# EAGLE design EVSE (EAGLE 6.5.0)
půkl
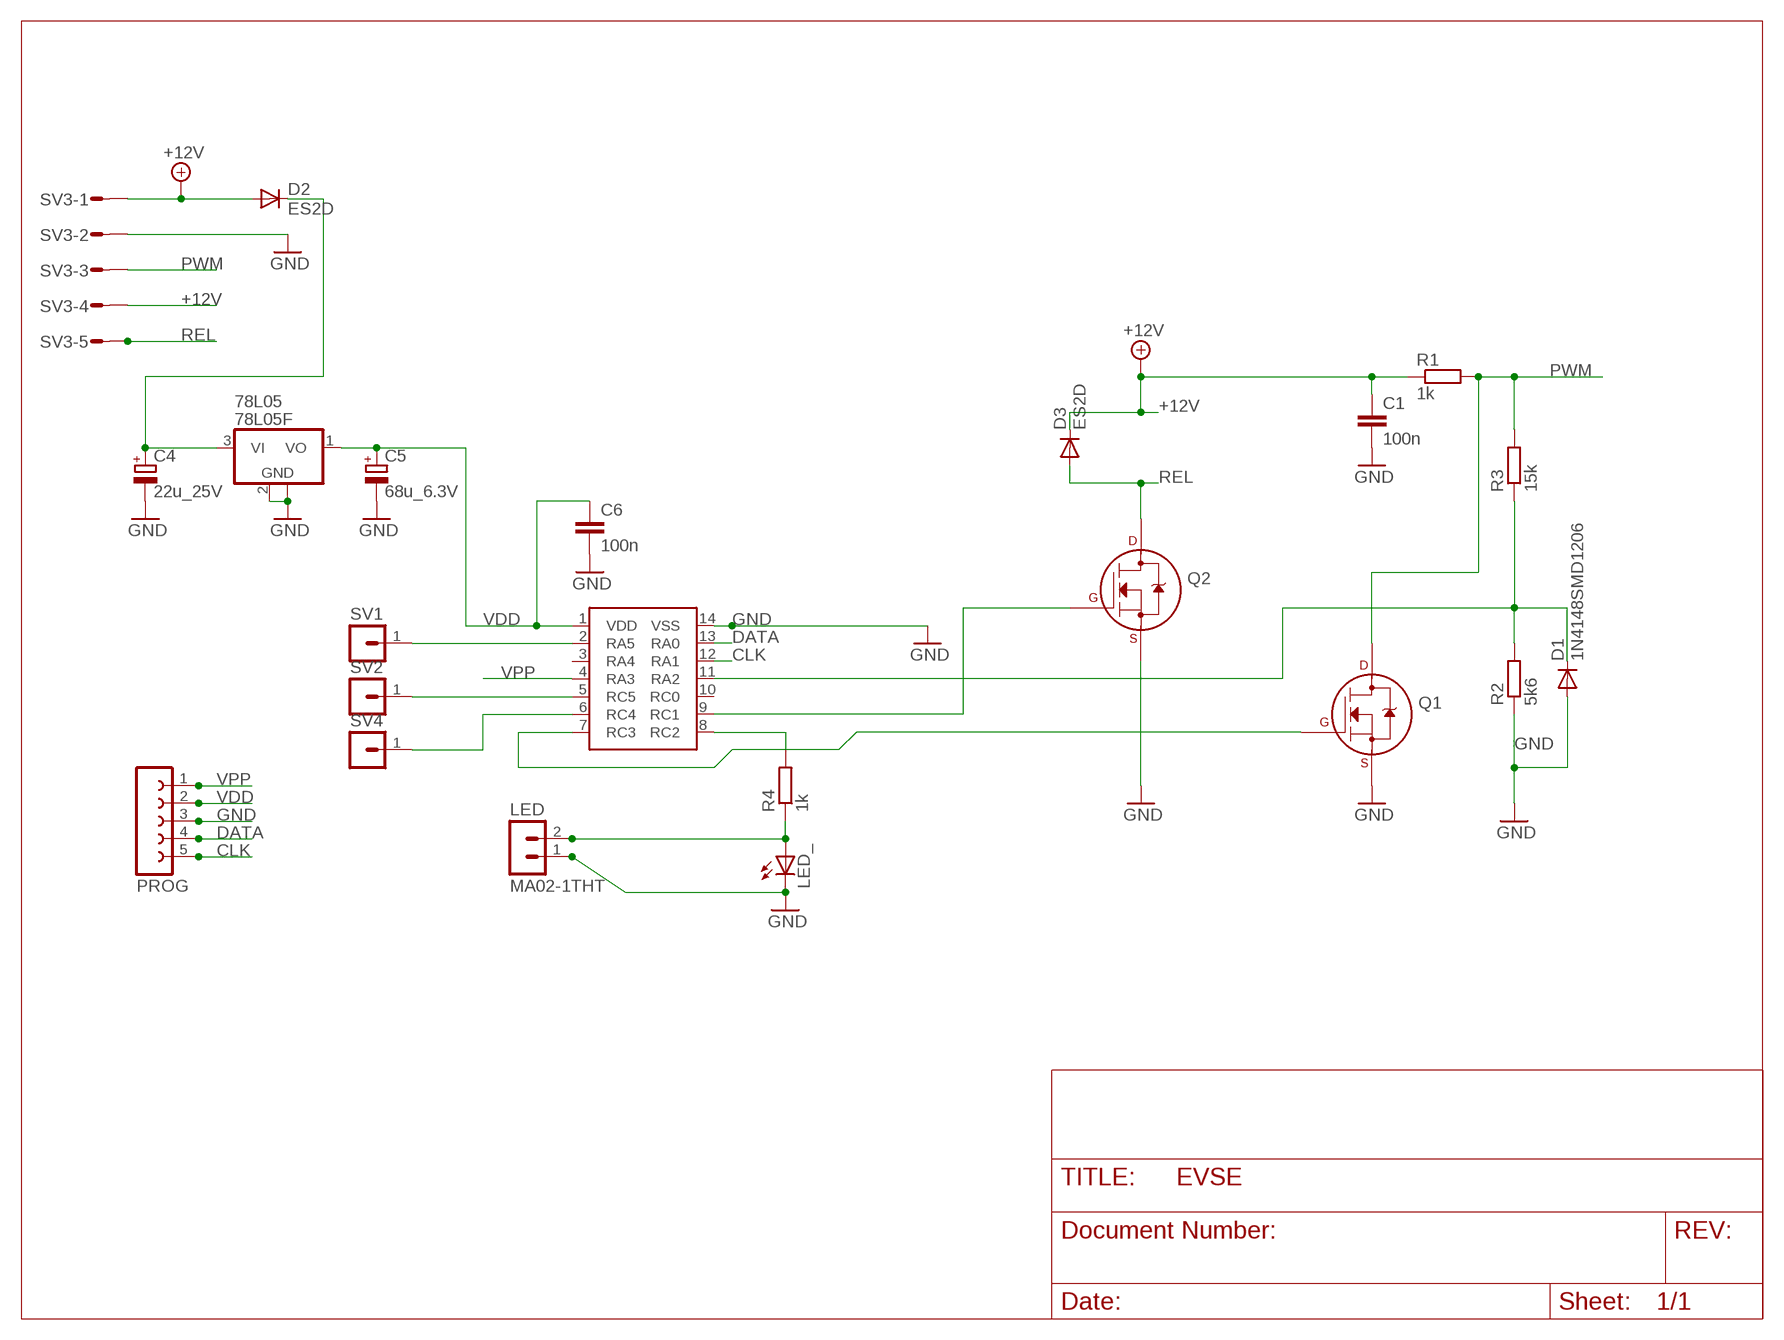
[diagram p0: schematic, sheet 1]

## Parts
78L05  78L05F  [SOT89]
C1  100n  C-EUC0805  [C0805]
C4  22u_25V  CPOL-EUB/3528-21W  [B/3528-21W]
C5  68u_6.3V  CPOL-EUB/3528-21W  [B/3528-21W]
C6  100n  C-EUC0805  [C0805]
D1  1N4148SMD1206  [D1206]
D2  ES2D  [SMB]
D3  ES2D  [SMB]
LED  MA02-1THT  [MA02-1]
LED_  LEDSMT1206  [1206]
PIC16F1825  PIC16F1825SOIC  [SO-14]
PROG  FE05-1  [FE05-1]
Q1  2N7002_SOT23  [SOT-23]
Q2  2N7002_SOT23  [SOT-23]
R1  1k  R-EU_R0805  [R0805]
R2  5k6  R-EU_R0805  [R0805]
R3  15k  R-EU_R0805  [R0805]
R4  1k  R-EU_R0805  [R0805]
SV1  PIN-HEADER1  [PIN-HEADER1]
SV2  PIN-HEADER1  [PIN-HEADER1]
SV3  MT6-5  [MT6-5]
SV4  PIN-HEADER1  [PIN-HEADER1]

## Nets
+12V: C1.1 D2.A D3.C R1.1 SV3.1 SV3.4
CLK: PIC16F1825.12(RA1) PROG.5
DATA: PIC16F1825.13(RA0) PROG.4
GND: 78L05.2(GND) 78L05.2@1(GND) C1.2 C4.- C5.- C6.2 D1.A LED.1 LED_.C PIC16F1825.14(VSS) PROG.3 Q1.2(S) Q2.2(S) R2.1 SV3.2
N$2: 78L05.3(VI) C4.+ D2.C
N$3: D1.C PIC16F1825.11(RA2) R2.2 R3.1
N$4: PIC16F1825.7(RC3) Q1.1(G)
N$5: PIC16F1825.2(RA5) SV1.1
N$6: PIC16F1825.9(RC1) Q2.1(G)
N$7: PIC16F1825.5(RC5) SV2.1
N$8: PIC16F1825.6(RC4) SV4.1
N$11: PIC16F1825.8(RC2) R4.2
N$12: LED.2 LED_.A R4.1
PWM: Q1.3(D) R1.2 R3.2 SV3.3
REL: D3.A Q2.3(D) SV3.5
VDD: 78L05.1(VO) C5.+ C6.1 PIC16F1825.1(VDD) PROG.2
VPP: PIC16F1825.4(RA3) PROG.1
Unconnected: PIC16F1825.3(RA4) PIC16F1825.10(RC0)

## Library data of the parts
78L05 = linear:78L*: POSITOIV-VOLTAGE REGULATORS Output up to 100 mA Source: http://focus.ti.com/lit/ds/symlink/ua78l05.pdf
C1 C6 = rcl:C-EU: CAPACITOR, European symbol
C4 C5 = rcl:CPOL-EU: POLARIZED CAPACITOR, European symbol
D1 = superlibrary:1N4148: DIODE high speed (Philips)
D2 D3 = diode:ES2D: DIODE super fast rectifier, 2 A
LED = superlibrary:MA02-1
LED_ = led:LED: LED OSRAM: - CHIPLED LG R971, LG N971, LY N971, LG Q971, LY Q971, LO R971, LY R971 LH N974, LH R974 LS Q976, LO Q976, LY Q976 LO Q996 - Hyper CHIPLED LW Q18S LB Q993, LB Q99A, LB R99A - SideLED LS A670, LO A670, LY A670, LG A670, LP A670 LB A673, LV A673, LT A673, LW A673 LH A674 LY A675 LS A676, LA A676, LO A676, LY A676, LW A676 LS A679, LY A679, LG A679 - Hyper Micro SIDELED® LS Y876, LA Y876, LO Y876, LY Y876 LT Y87S - SmartLED LW L88C, LW L88S LB L89C, LB L89S, LG L890 LS L89K, LO L89K, LY L89K LS L896, LA L896, LO L896, LY L896 - TOPLED LS T670, LO T670, LY T670, LG T670, LP T670 LSG T670, LSP T670, LSY T670, LOP T670, LYG T670 LG T671, LOG T671, LSG T671 LB T673, LV T673, LT T673, LW T673 LH T674 LS T676, LA T676, LO T676, LY T676, LB T676, LH T676, LSB T676, LW T676 LB T67C, LV T67C, LT T67C, LS T67K, LO T67K, LY T67K, LW E67C LS E67B, LA E67B, LO E67B, LY E67B, LB E67C, LV E67C, LT E67C LW T67C LS T679, LY T679, LG T679 LS T770, LO T770, LY T770, LG T770, LP T770 LB T773, LV T773, LT T773, LW T773 LH T774 LS E675, LA E675, LY E675, LS T675 LS T776, LA T776, LO T776, LY T776, LB T776 LHGB T686 LT T68C, LB T68C - Hyper Mini TOPLED® LB M676 - Mini TOPLED Santana® LG M470 LS M47K, LO M47K, LY M47K Source: http://www.osram.convergy.de LUXEON: - LUMILED® LXK2-PW12-R00, LXK2-PW12-S00, LXK2-PW14-U00, LXK2-PW14-V00 LXK2-PM12-R00, LXK2-PM12-S00, LXK2-PM14-U00 LXK2-PE12-Q00, LXK2-PE12-R00, LXK2-PE12-S00, LXK2-PE14-T00, LXK2-PE14-U00 LXK2-PB12-K00, LXK2-PB12-L00, LXK2-PB12-M00, LXK2-PB14-N00, LXK2-PB14-P00, LXK2-PB14-Q00 LXK2-PR12-L00, LXK2-PR12-M00, LXK2-PR14-Q00, LXK2-PR14-R00 LXK2-PD12-Q00, LXK2-PD12-R00, LXK2-PD12-S00 LXK2-PH12-R00, LXK2-PH12-S00 LXK2-PL12-P00, LXK2-PL12-Q00, LXK2-PL12-R00 Source: www.luxeon.com KINGBRIGHT: KA-3528ASYC Source: www.kingbright.com
PIC16F1825 = PIC16F1825:PIC16F1825
PROG = con-lsta:FE05-1: FEMALE HEADER; OC_FARNELL: unknown; OC_NEWARK: unknown
Q1 Q2 = transistors:2N700*: 2N7000, 2N7002, NDS7002A N-channel enhancement mode MOSFET
R1-R4 = resistor:R-EU_: RESISTOR, European symbol
SV1 SV2 SV4 = superlibrary:PIN-HEADER1: PIN HEADER; OC_FARNELL: unknown; OC_NEWARK: unknown
SV3 = superlibrary:MT6-5: AMP MT6 CONNECTOR; OC_FARNELL: unknown; OC_NEWARK: unknown

## Board
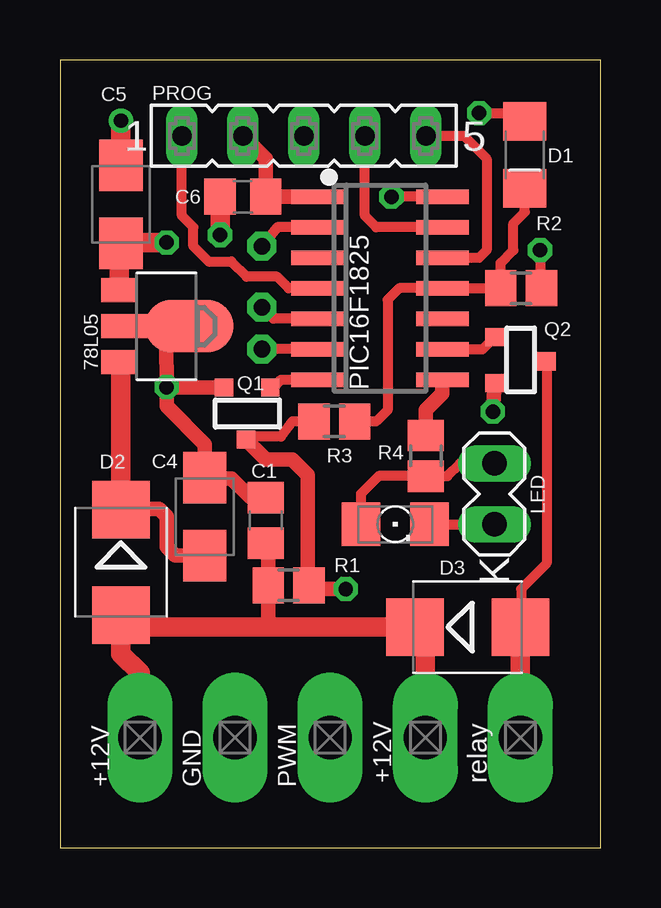
[diagram p1: board, top side]
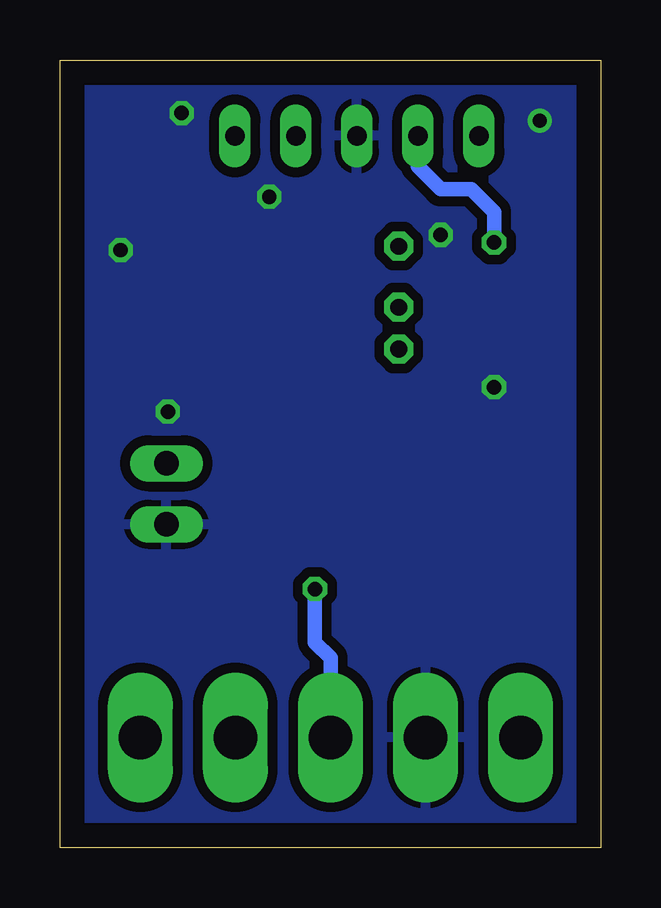
[diagram p2: board, bottom side, seen from below]

Size 22.53 x 32.85 mm. Coordinates in mm from the lower left corner, seen from the top.
Outline: 0,0 22.53,0 22.53,32.85 0,32.85 0,0
Copper layers (1*16): Top 0.035mm / dielectric 1.5mm / Bottom 0.035mm
Design rules "default *": minimum track width 10mil, minimum drill 20mil, track to track 8mil, track to pad 8mil, pad to pad 8mil, via to via 8mil, smd to smd 8mil, copper to edge 40mil, drill to drill 8mil, minimum pad ring 10mil, minimum via ring 8mil, stop-mask expansion 4mil, vias tented up to drill 0mil, thermal gap 10mil

### Footprints (pad centres in the part's own frame; a part is rotated, then mirrored left to right if it is on the bottom)
SOT89 = smd 1 x 1.5: 1 -1.499,-1.981; 3 1.499,-1.981 | smd 1 x 2: 2 0,-1.727 | smd 2.2 x 3.7: 2@1 0,0.94
C0805 = smd 1.3 x 1.5: 1 -0.95,0; 2 0.95,0
B/3528-21W = smd 2.15 x 1.8: + 1.625,0; - -1.625,0
D1206 = smd 1.6 x 1.8: A -1.4,0; C 1.4,0
SMB = smd 2.4 x 2.4: A 2.2,0; C -2.2,0
MA02-1 = drill 1.016 long: 1 -2.54,0; 2 0,0
1206 = smd 1.6 x 1.803: A -1.422,0; C 1.422,0
SO-14 = smd 0.6 x 2.2: 1 -3.81,-2.6; 2 -2.54,-2.6; 3 -1.27,-2.6; 4 0,-2.6; 5 1.27,-2.6; 6 2.54,-2.6; 7 3.81,-2.6; 8 3.81,2.6; 9 2.54,2.6; 10 1.27,2.6; 11 0,2.6; 12 -1.27,2.6; 13 -2.54,2.6; 14 -3.81,2.6
FE05-1 = drill 0.813 long: 1 -5.08,0; 2 -2.54,0; 3 0,0; 4 2.54,0; 5 5.08,0
SOT-23 = smd 0.762 x 0.762: 1 -0.979,-1.101; 2 0.94,-1.101; 3 0.025,1.067
R0805 = smd 1.3 x 1.5: 1 -0.85,0; 2 0.85,0
PIN-HEADER1 = drill 0.7 octagon: 1 0,0
MT6-5 = drill 1.803 long: 1 2.54,0; 2 6.502,0; 3 10.465,0; 4 14.427,0; 5 18.39,0

### Placement (x,y rotation side)
78L05  4.45,21.75 270 top
C1  8.57,13.65 90 top
C4  6.03,13.81 270 top
C5  2.54,26.83 270 top
C6  7.62,27.15 180 top
D1  19.37,28.89 270 top
D2  2.54,11.91 270 top
D3  16.99,9.21 0 top
LED  18.1,16.03 90 top
LED_  13.97,13.49 0 top
PIC16F1825  13.34,23.34 270 top
PROG  10.16,29.69 0 top
Q1  7.78,18.1 180 top
Q2  19.21,20.32 270 top
R1  9.53,10.95 0 top
R2  19.21,23.34 180 top
R3  11.43,17.78 180 top
R4  15.24,16.35 90 top
SV1  8.41,25.08 0 top
SV2  8.41,22.54 0 top
SV3  0.79,4.6 0 top
SV4  8.41,20.8 0 top

### Tracks (layer width: path | path; a pad name or v marks a point on that pad's centre or on a via)
+12V
  Top 0.61: C1.1 8.68,12.6 R1.1 8.68,9.26 8.73,9.21
  Top 0.813: SV3.1 3.33,7.3 2.54,8.1 D2.A 3.04,9.21 8.73,9.21 D3.C 15.22,8.77 SV3.4
CLK
  Top 0.406: PIC16F1825.12 17.46,24.61 17.78,24.92 17.78,28.73 16.83,29.69 PROG.5
DATA
  Top 0.406: PIC16F1825.13 13.18,25.88 12.7,26.35 PROG.4
GND  (via drill 0.6)
  Top 0.406: PIC16F1825.14 v13.81,27.15 | v4.46,19.2 v4.45,19.21 | v20,24.92 20,23.39 R2.1 | LED_.C LED.1 | v17.46,30.64 19.02,30.64 D1.A
  Top 0.61: Q2.2 v18.03,18.19 | 78L05.2 78L05.2@1 4.43,21.1 v4.45,19.21 4.45,18.42 6.03,16.83 C4.- 6.07,15.4 7.14,15.4 7.94,14.6 C1.2 | Q1.2 v4.46,19.2
  Top 0.813: C5.- v2.54,30.32 | C6.2 v6.67,25.56
  pour Bottom (isolate 0.406): 0,32.86 0,-2.7 26.04,-2.7 26.04,32.86
N$2
  Top 0.406: 2.56,14.13 D2.C
  Top 0.61: C4.+ 4.8,12.19 4.45,12.54 4.45,13.81 4.13,14.13 2.56,14.13 | 2.54,20.17 78L05.3
  Top 0.813: D2.C 2.54,18.59 2.54,20.17
N$3
  Top 0.406: R3.1 13.18,17.78 13.65,18.26 13.65,22.86 14.13,23.34 PIC16F1825.11 R2.2 18.36,24.39 18.89,24.92 18.89,26.04 19.37,26.51 D1.C
N$4
  Top 0.406: Q1.1 8.88,19.2 9.21,19.53 PIC16F1825.7
N$5
  Top 0.406: PIC16F1825.2 9.05,25.88 SV1.1
N$6
  Top 0.406: PIC16F1825.9 17.6,20.8 Q2.1
N$7
  Top 0.406: PIC16F1825.5 8.89,22.07 SV2.1
N$8
  Top 0.406: PIC16F1825.6 SV4.1
N$11
  Top 0.61: R4.2 15.24,18.26 15.94,18.95 PIC16F1825.8
N$12
  Top 0.406: LED.2 16.67,16.03 16.14,15.5 R4.1 13.28,15.5 12.54,14.76 LED_.A
PWM  (via drill 0.6)
  Top 0.406: R3.2 9.68,17.78 9.21,17.15 7.87,17.15 Q1.3
  Top 0.61: Q1.3 7.75,17.01 8.57,16.19 9.68,16.19 10.32,15.56 10.32,11.01 R1.2 10.53,10.8 v11.91,10.8
  Bottom 0.61: v11.91,10.8 11.91,8.57 11.26,7.93 SV3.3
REL
  Top 0.406: Q2.3 20.28,11.86 19.21,10.8 19.21,9.23 D3.A
  Top 0.813: SV3.5 D3.A
VDD  (via drill 0.6)
  Top 0.406: 2.46,25.13 C5.+
  Top 0.61: PROG.2 8.57,28.74 C6.1 PIC16F1825.1 | 2.58,25.24 C5.+
  Top 0.813: v4.45,25.24 2.58,25.24 | 78L05.1 2.46,25.13
  Bottom 0.61: v4.45,25.24 4.45,26.51 5.4,27.46 6.67,27.46 7.62,28.42 PROG.2
VPP
  Top 0.406: PIC16F1825.4 9.53,23.34 9.05,23.81 7.78,23.81 7.14,24.45 6.19,24.45 5.56,25.08 5.56,25.88 5.08,26.35 PROG.1

### Text on the board
tNames: +12V | GND | PWM | +12V | relay